# Altium schematic sheet audio_main.SchDoc: mcHF Pro Transceiver UI board
size A3; Author: Krassi Atanassov; CompanyName: MØNKA; Engineer: For radio amateurs experimentation, non-commercial use only. Thank you!; Revision: 0.8.2; SheetTotal: 18
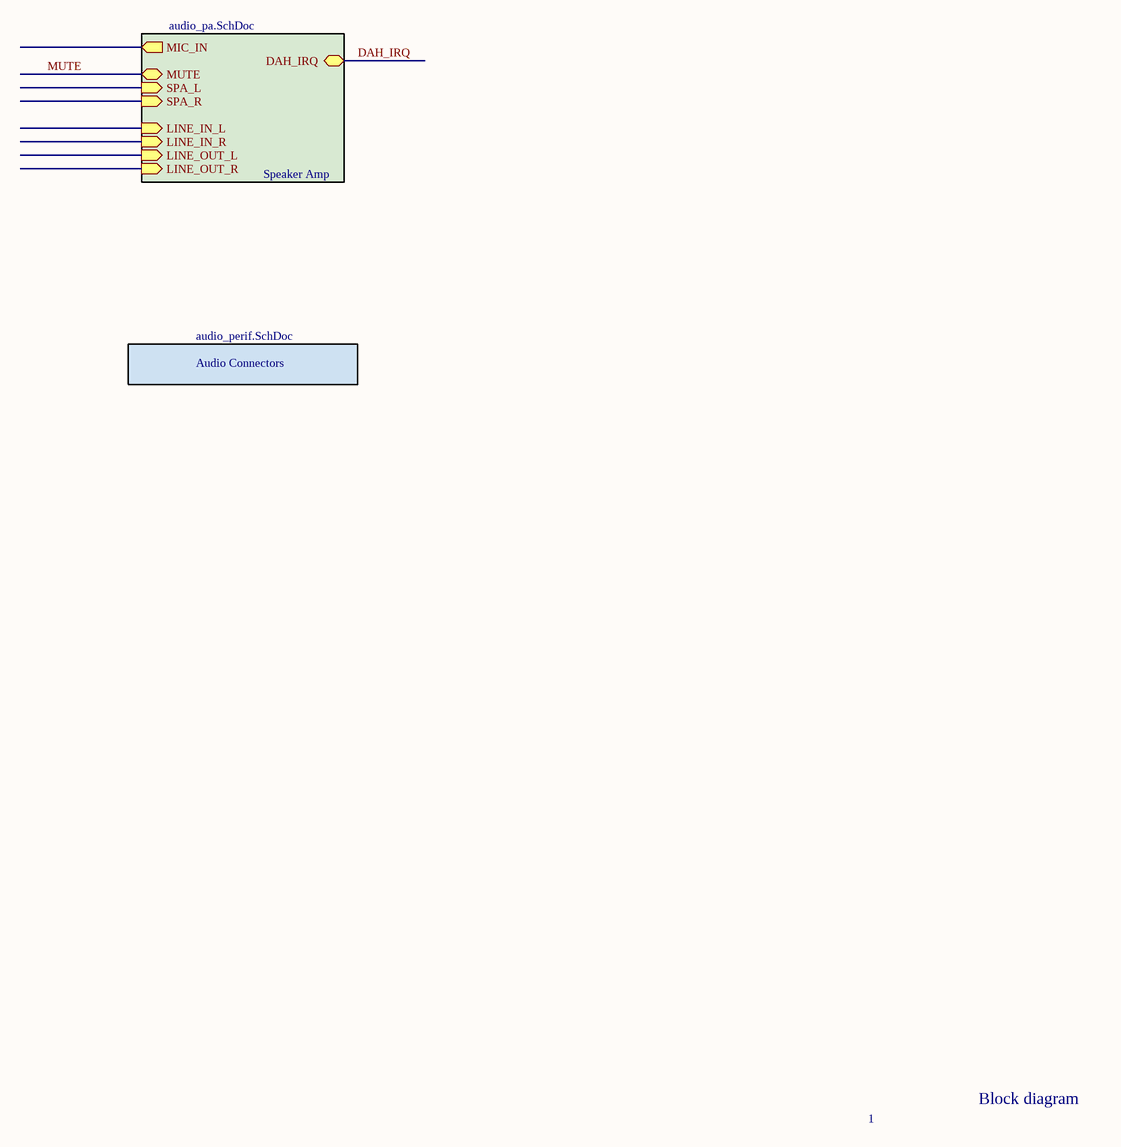
[diagram p0: audio_main.SchDoc]

## Sub-sheets
Audio Connectors = audio_perif.SchDoc: no entries
Speaker Amp = audio_pa.SchDoc: DAH_IRQ (bidir), MIC_IN (out), SPA_L (in), MUTE (bidir), LINE_IN_L (in), LINE_IN_R (in), LINE_OUT_L (in), LINE_OUT_R (in), SPA_R (in)

## Nets
DAH_IRQ: sheet Speaker Amp/DAH_IRQ
MUTE: sheet Speaker Amp/MUTE

## Notes on the sheet
- 1
- Block diagram
- Date:
- File:
- Revision:
- Sheet
- of
- License: